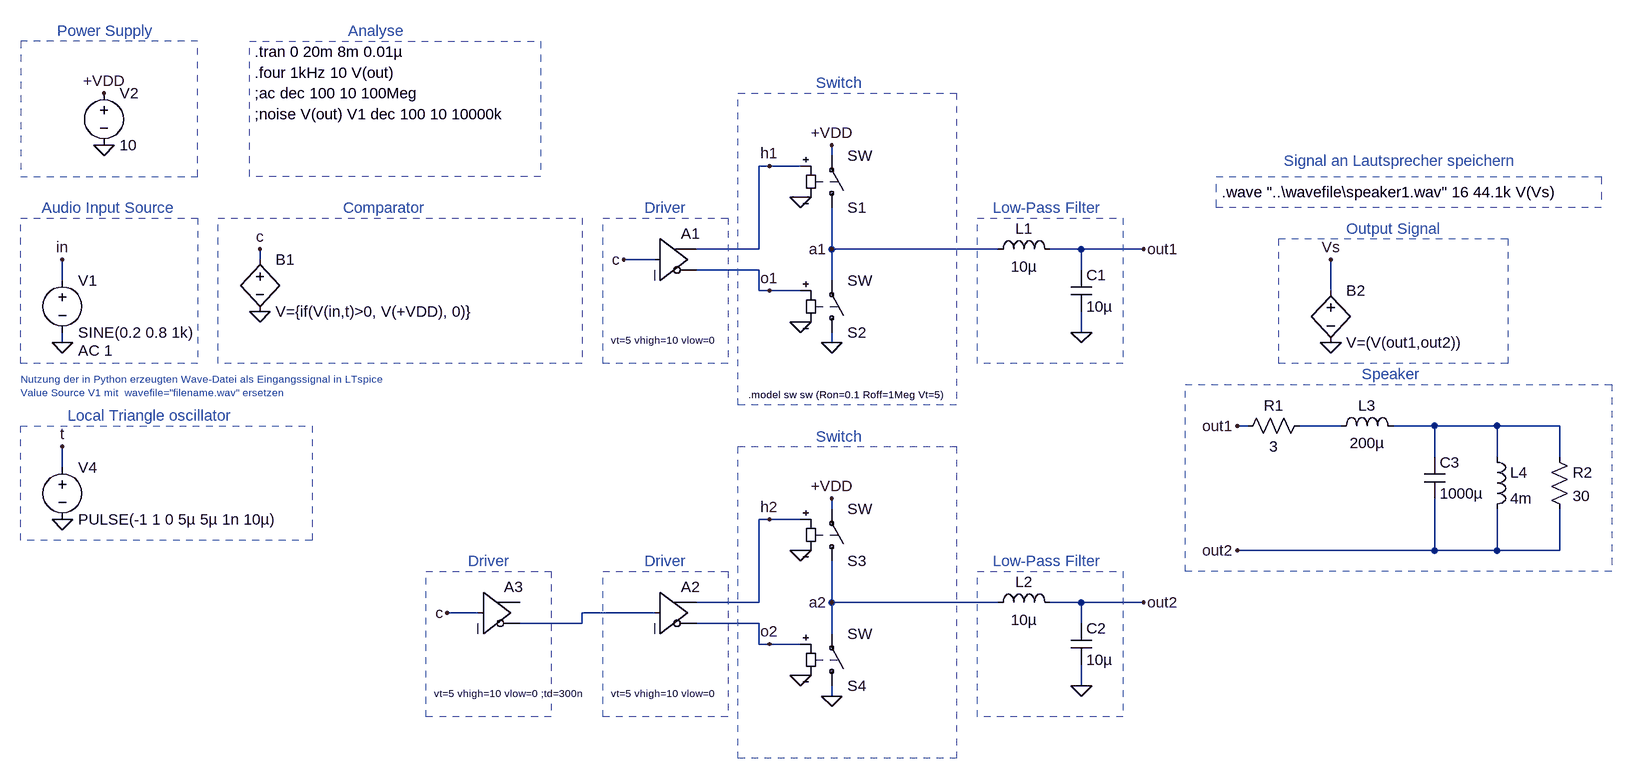
[diagram p0: schematic V6_AD_mit_1khz_sine.asc]
V6_AD_mit_1khz_sine.asc, the LTspice schematic file:
Version 4
SHEET 1 1844 744
WIRE 384 -192 384 -208
WIRE 288 -176 272 -176
WIRE 336 -176 288 -176
WIRE 272 -48 272 -176
WIRE 272 -48 176 -48
WIRE 384 -48 384 -112
WIRE 640 -48 384 -48
WIRE 768 -48 720 -48
WIRE 864 -48 768 -48
WIRE -496 -32 -496 -48
WIRE 112 -32 64 -32
WIRE 272 -16 176 -16
WIRE 768 -16 768 -48
WIRE -800 0 -800 -32
WIRE 384 0 384 -48
WIRE 272 16 272 -16
WIRE 288 16 272 16
WIRE 336 16 288 16
WIRE 1152 16 1152 -32
WIRE 768 80 768 48
WIRE -800 96 -800 80
WIRE 384 96 384 80
WIRE 1024 224 1008 224
WIRE 1168 224 1104 224
WIRE 1312 224 1248 224
WIRE 1408 224 1312 224
WIRE 1504 224 1408 224
WIRE 1312 272 1312 224
WIRE 1408 272 1408 224
WIRE 1504 272 1504 224
WIRE -800 288 -800 256
WIRE 384 352 384 336
WIRE 288 368 272 368
WIRE 336 368 288 368
WIRE 1312 416 1312 336
WIRE 1312 416 1008 416
WIRE 1408 416 1408 352
WIRE 1408 416 1312 416
WIRE 1504 416 1504 352
WIRE 1504 416 1408 416
WIRE 272 496 272 368
WIRE 272 496 176 496
WIRE 384 496 384 432
WIRE 640 496 384 496
WIRE 768 496 720 496
WIRE 864 496 768 496
WIRE -160 512 -208 512
WIRE 112 512 0 512
WIRE 0 528 0 512
WIRE 0 528 -96 528
WIRE 272 528 176 528
WIRE 768 528 768 496
WIRE 384 544 384 496
WIRE 272 560 272 528
WIRE 288 560 272 560
WIRE 336 560 288 560
WIRE 768 624 768 592
WIRE 384 640 384 624
FLAG -800 96 0
FLAG -736 -288 +VDD
FLAG -800 256 t
FLAG 64 -32 c
FLAG 288 -176 h1
FLAG 288 16 o1
FLAG -800 -32 in
FLAG 384 -48 a1
FLAG -800 368 0
FLAG -736 -208 0
FLAG 768 80 0
FLAG 864 -48 out1
FLAG -496 48 0
FLAG -496 -48 c
FLAG 384 -208 +VDD
FLAG 288 368 h2
FLAG 288 560 o2
FLAG 384 496 a2
FLAG 768 624 0
FLAG 384 336 +VDD
FLAG 864 496 out2
FLAG -208 512 c
FLAG 336 -128 0
FLAG 336 64 0
FLAG 384 96 0
FLAG 336 416 0
FLAG 336 608 0
FLAG 384 640 0
FLAG 1008 224 out1
FLAG 1008 416 out2
FLAG 1152 96 0
FLAG 1152 -32 Vs
SYMBOL voltage -800 -16 R0
WINDOW 123 24 124 Left 2
WINDOW 39 0 0 Left 0
SYMATTR Value2 AC 1
SYMATTR InstName V1
SYMATTR Value SINE(0.2 0.8 1k)
SYMBOL Digital\\buf 112 -96 R0
WINDOW 3 -68 188 Left 1
SYMATTR Value vt=5 vhigh=10 vlow=0
SYMATTR InstName A1
SYMBOL sw 384 -96 M180
SYMATTR InstName S1
SYMBOL sw 384 96 M180
SYMATTR InstName S2
SYMBOL ind 624 -32 R270
WINDOW 0 32 56 VTop 2
WINDOW 3 5 56 VBottom 2
SYMATTR InstName L1
SYMATTR Value 10µ
SYMBOL cap 752 -16 R0
SYMATTR InstName C1
SYMATTR Value 10µ
SYMBOL voltage -736 -304 R0
WINDOW 123 0 0 Left 0
WINDOW 39 0 0 Left 0
SYMATTR InstName V2
SYMATTR Value 10
SYMBOL voltage -800 272 R0
WINDOW 123 0 0 Left 0
WINDOW 39 0 0 Left 0
SYMATTR Value PULSE(-1 1 0 5µ 5µ 1n 10µ)
SYMATTR InstName V4
SYMBOL bv -496 -48 R0
SYMATTR InstName B1
SYMATTR Value V={if(V(in,t)>0, V(+VDD), 0)}
SYMBOL Digital\\buf 112 448 R0
WINDOW 3 -68 188 Left 1
SYMATTR Value vt=5 vhigh=10 vlow=0
SYMATTR InstName A2
SYMBOL sw 384 448 M180
SYMATTR InstName S3
SYMBOL sw 384 640 M180
SYMATTR InstName S4
SYMBOL ind 624 512 R270
WINDOW 0 32 56 VTop 2
WINDOW 3 5 56 VBottom 2
SYMATTR InstName L2
SYMATTR Value 10µ
SYMBOL cap 752 528 R0
SYMATTR InstName C2
SYMATTR Value 10µ
SYMBOL Digital\\buf -160 448 R0
WINDOW 3 -68 188 Left 1
SYMATTR Value vt=5 vhigh=10 vlow=0 ;td=300n
SYMATTR InstName A3
SYMBOL res 1120 208 R90
WINDOW 0 0 56 VBottom 2
WINDOW 3 32 56 VTop 2
SYMATTR InstName R1
SYMATTR Value 3
SYMBOL res 1488 256 R0
SYMATTR InstName R2
SYMATTR Value 30
SYMBOL ind 1152 240 R270
WINDOW 0 32 56 VTop 2
WINDOW 3 5 56 VBottom 2
SYMATTR InstName L3
SYMATTR Value 200µ
SYMBOL cap 1296 272 R0
SYMATTR InstName C3
SYMATTR Value 1000µ
SYMBOL ind 1392 256 R0
SYMATTR InstName L4
SYMATTR Value 4m
SYMBOL bv 1152 0 R0
SYMATTR InstName B2
SYMATTR Value V=(V(out1,out2))
TEXT 256 176 Left 1 !.model sw sw (Ron=0.1 Roff=1Meg Vt=5)
TEXT -832 -112 Left 2 ;Audio Input Source
TEXT -792 208 Left 2 ;Local Triangle oscillator
TEXT -504 -352 Left 2 !.tran 0 20m 8m 0.01µ
TEXT -504 -320 Left 2 !.four 1kHz 10 V(out)
TEXT -504 -288 Left 2 !;ac dec 100 10 100Meg
TEXT -504 -256 Left 2 !;noise V(out) V1 dec 100 10 10000k
TEXT -808 -384 Left 2 ;Power Supply
TEXT -360 -384 Left 2 ;Analyse
TEXT -368 -112 Left 2 ;Comparator
TEXT 360 -304 Left 2 ;Switch
TEXT 632 -112 Left 2 ;Low-Pass Filter
TEXT 96 -112 Left 2 ;Driver
TEXT -864 152 Left 1 ;Nutzung der in Python erzeugten Wave-Datei als Eingangssignal in LTspice\nValue Source V1 mit  wavefile="filename.wav" ersetzen
TEXT 360 240 Left 2 ;Switch
TEXT 632 432 Left 2 ;Low-Pass Filter
TEXT 96 432 Left 2 ;Driver
TEXT -176 432 Left 2 ;Driver
TEXT 1200 144 Left 2 ;Speaker
TEXT 984 -136 Left 2 !.wave "..\\wavefile\\speaker1.wav" 16 44.1k V(Vs)
TEXT 1080 -184 Left 2 ;Signal an Lautsprecher speichern
TEXT 1176 -80 Left 2 ;Output Signal
RECTANGLE Normal -592 128 -864 -96 2
RECTANGLE Normal 224 128 32 -96 2
RECTANGLE Normal 576 192 240 -288 2
RECTANGLE Normal 832 128 608 -96 2
RECTANGLE Normal -592 -368 -864 -160 2
RECTANGLE Normal -64 -160 -512 -368 2
RECTANGLE Normal -416 400 -864 224 2
RECTANGLE Normal 0 128 -560 -96 2
RECTANGLE Normal 224 672 32 448 2
RECTANGLE Normal 576 736 240 256 2
RECTANGLE Normal 832 672 608 448 2
RECTANGLE Normal -48 672 -240 448 2
RECTANGLE Normal 1584 448 928 160 2
RECTANGLE Normal 1568 -112 976 -160 2
RECTANGLE Normal 1424 128 1072 -64 2

The netlist it stands for:
* V6_AD_mit_1khz_sine.asc
V1 in 0 SINE(0.2 0.8 1k) AC 1
A1 c 0 0 0 0 o1 h1 0 BUF vt=5 vhigh=10 vlow=0
S1 a1 +VDD h1 0 SW
S2 0 a1 o1 0 SW
L1 a1 out1 10µ
C1 out1 0 10µ
V2 +VDD 0 10
V4 t 0 PULSE(-1 1 0 5µ 5µ 1n 10µ)
B1 c 0 V={if(V(in,t)>0, V(+VDD), 0)}
A2 N003 0 0 0 0 o2 h2 0 BUF vt=5 vhigh=10 vlow=0
S3 a2 +VDD h2 0 SW
S4 0 a2 o2 0 SW
L2 a2 out2 10µ
C2 out2 0 10µ
A3 c 0 0 0 0 N003 0 0 BUF vt=5 vhigh=10 vlow=0 ;td=300n
R1 N001 out1 3
R2 N002 out2 30
L3 N001 N002 200µ
C3 N002 out2 1000µ
L4 N002 out2 4m
B2 Vs 0 V=(V(out1,out2))
.model sw sw (Ron=0.1 Roff=1Meg Vt=5)
* Audio Input Source
* Local Triangle oscillator
.tran 0 20m 8m 0.01µ
.four 1kHz 10 V(out)
;ac dec 100 10 100Meg
;noise V(out) V1 dec 100 10 10000k
* Power Supply
* Analyse
* Comparator
* Switch
* Low-Pass Filter
* Driver
* Nutzung der in Python erzeugten Wave-Datei als Eingangssignal in LTspice
* Value Source V1 mit  wavefile="filename.wav" ersetzen
* Switch
* Low-Pass Filter
* Driver
* Driver
* Speaker
.wave "..\wavefile\speaker1.wav" 16 44.1k V(Vs)
* Signal an Lautsprecher speichern
* Output Signal
.backanno
.end